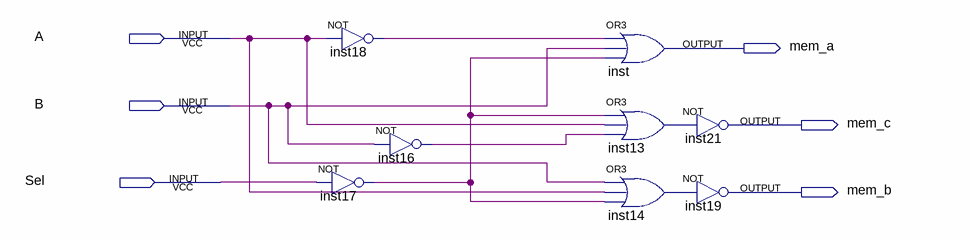
[diagram p0: schematic sheet]
// Quartus schematic seletor.bdf as structural Verilog: 8 symbols, 6 pins
module seletor (
  input  A,
  input  B,
  input  Sel,
  output mem_a,
  output mem_c,
  output mem_b
);

  wire inst13_out, inst14_out, inst16_out, inst17_out, inst18_out;

  not inst18 (inst18_out, A);
  not inst16 (inst16_out, B);
  not inst17 (inst17_out, Sel);
  or inst (mem_a, inst18_out, B, inst17_out);
  or inst13 (inst13_out, inst17_out, A, inst16_out);
  or inst14 (inst14_out, B, A, inst17_out);
  not inst21 (mem_c, inst13_out);
  not inst19 (mem_b, inst14_out);
endmodule
